# Altium project TIDA-010933-RevA.PrjPcb (part 1 of 8)
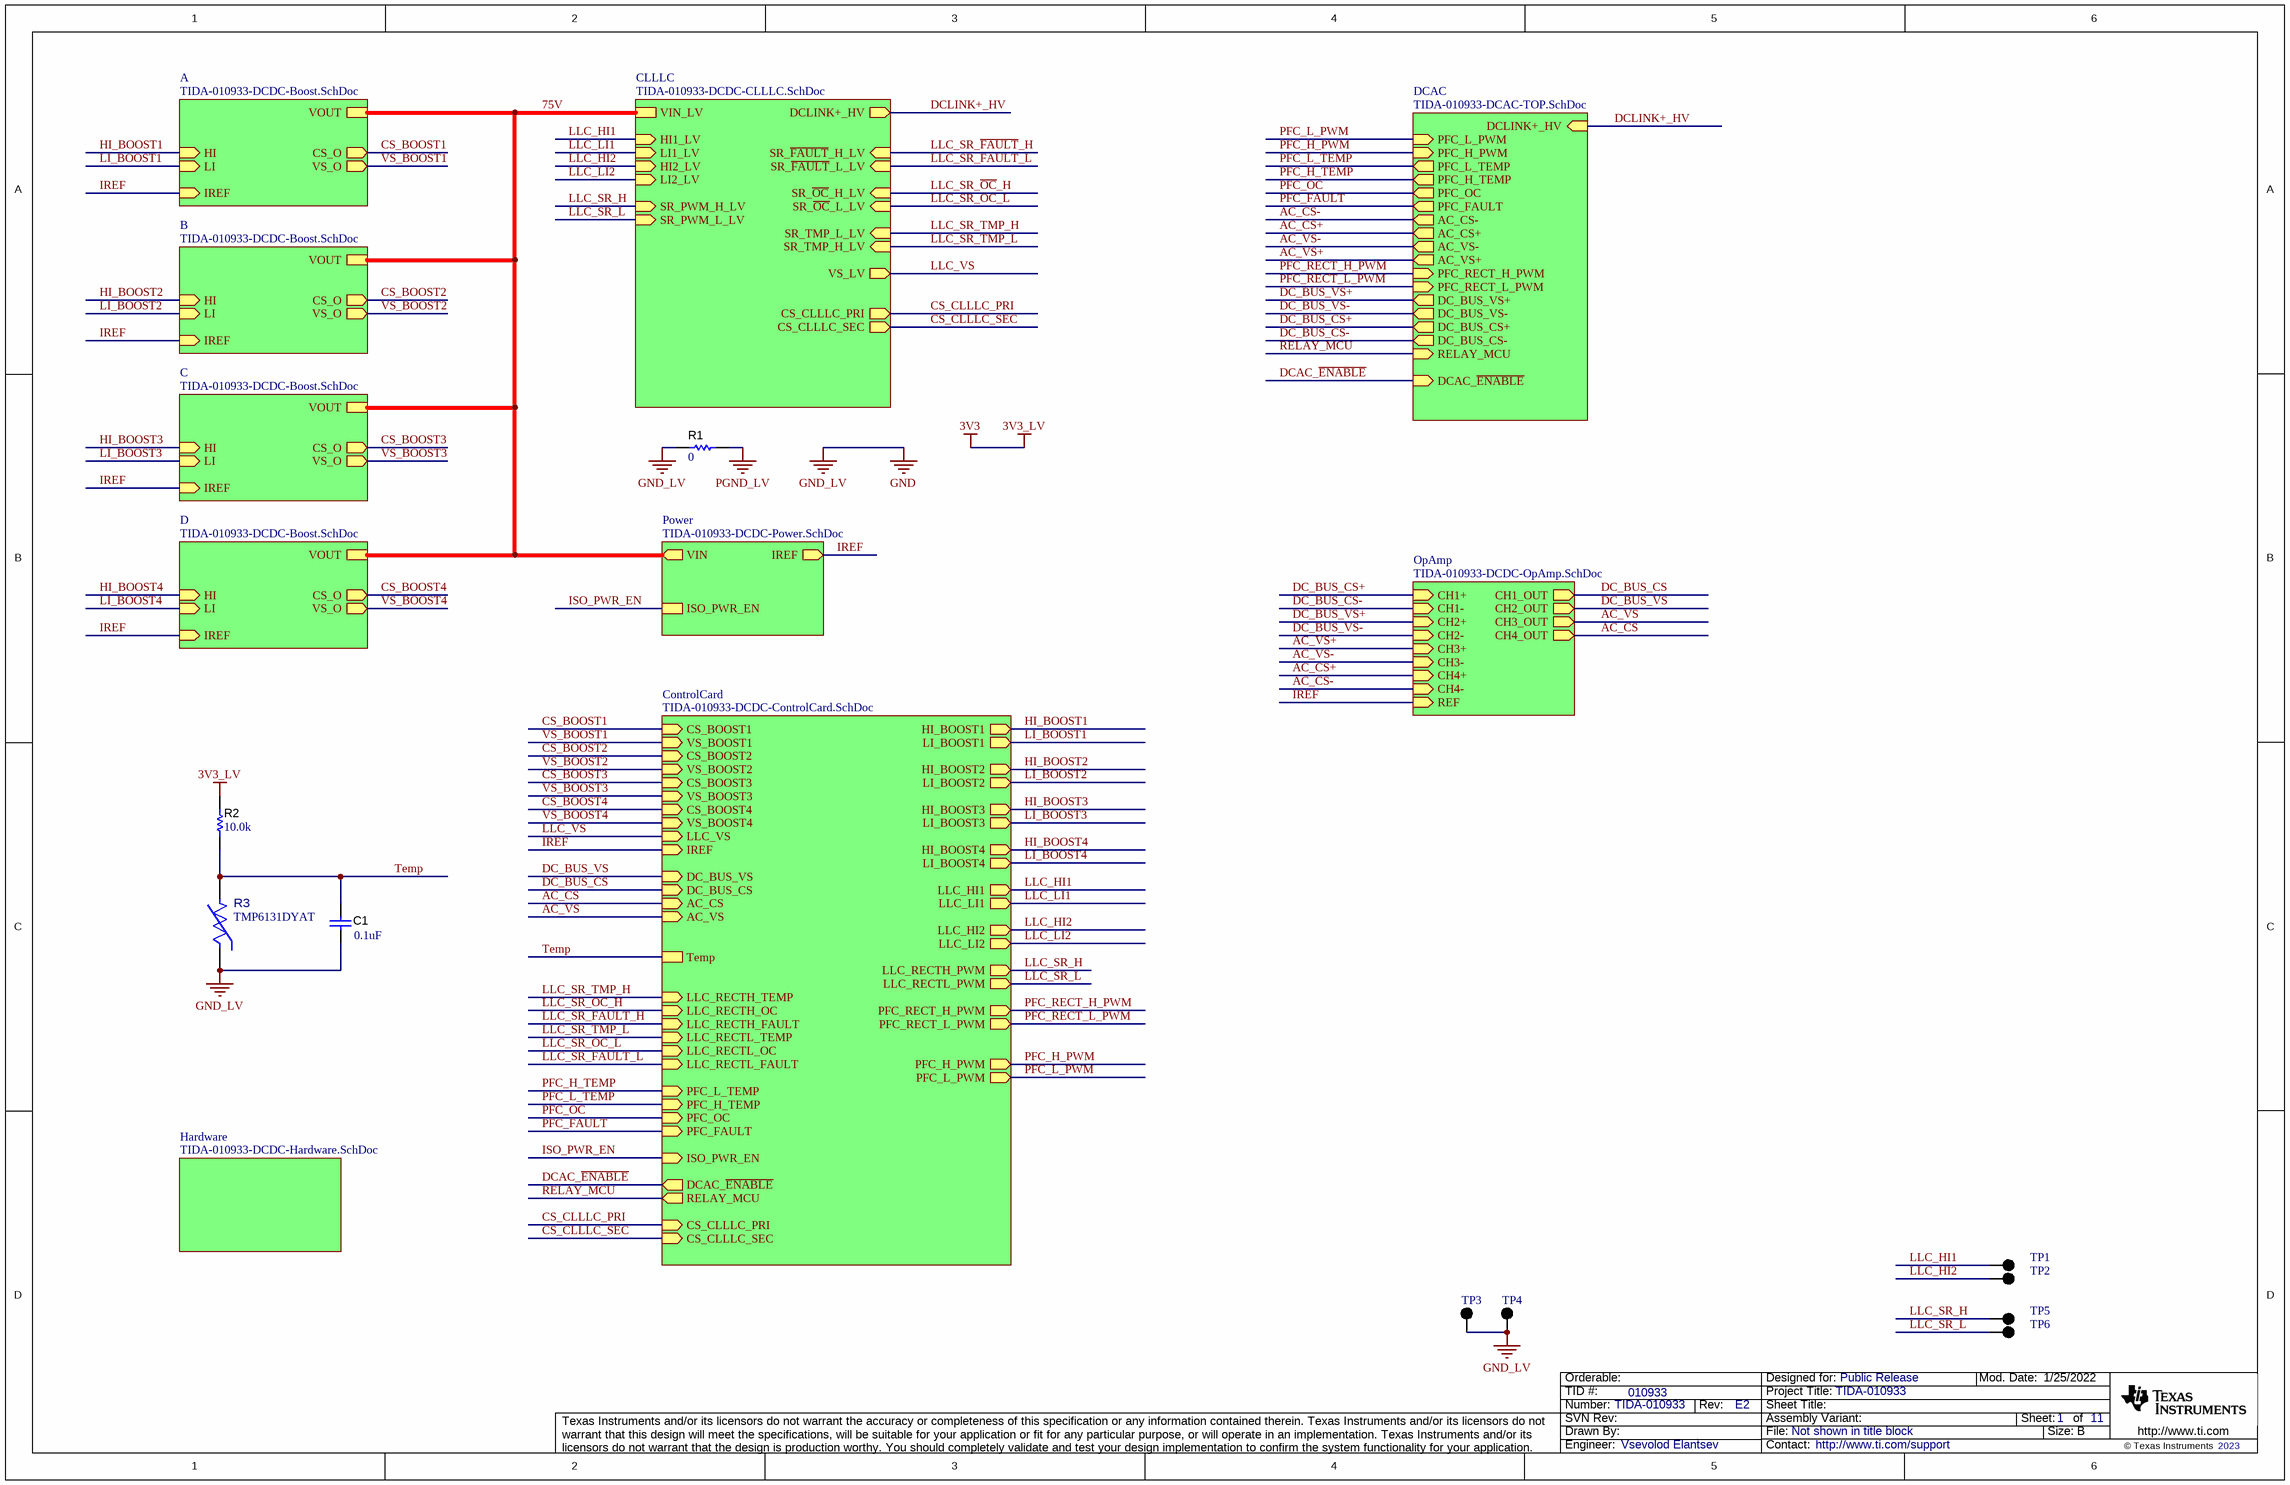
[diagram p0: TIDA-010933-DCDC-Top.SchDoc]
CopyrightYear: 2023; PCB_Rev: E2; PRJ_Customer: Public Release; PRJ_Engineer: Vsevolod Elantsev; PRJ_Number: TIDA-010933; PRJ_Title: TIDA-010933; SCH_Rev: E2; TechSupport: http://www.ti.com/support; TID: 010933; Vsevolod Elantsev: Who did the Layout?
11 sheets, 778 parts. Net scope: hierarchical (ports join the sheet entries above them; power ports are global).
Board file: TIDA-010933-RevA.PcbDoc
Sheets:
  TIDA-010933-DCDC-Top.SchDoc
    A = TIDA-010933-DCDC-Boost.SchDoc
    CLLLC = TIDA-010933-DCDC-CLLLC.SchDoc
      HV_GaN = TIDA-010933-DCDC-HVGAN.SchDoc
    B = TIDA-010933-DCDC-Boost.SchDoc
    C = TIDA-010933-DCDC-Boost.SchDoc
    D = TIDA-010933-DCDC-Boost.SchDoc
    Hardware = TIDA-010933-DCDC-Hardware.SchDoc
    Power = TIDA-010933-DCDC-Power.SchDoc
    ControlCard = TIDA-010933-DCDC-ControlCard.SchDoc
    OpAmp = TIDA-010933-DCDC-OpAmp.SchDoc
    DCAC = TIDA-010933-DCAC-TOP.SchDoc
      U_Power_Switches_1 = TIDA-010933-DCAC-SWITCHING-STAGE.SchDoc
      U_Aux_Power_Supply = TIDA-010933-DCAC-AUX-Power.SchDoc

## Sheet TIDA-010933-DCDC-Top.SchDoc
size 431 x 279 mm; Date: Not shown in title block; ApprovedBy: Not shown in title block; CheckedBy: Not shown in title block; Author: Not shown in title block; CompanyName: Not shown in title block; Engineer: Not shown in title block; Organization: Not shown in title block; Address1: Not shown in title block; Address2: Not shown in title block; Address3: Not shown in title block; Address4: Not shown in title block; DocumentNumber: 2; Revision: Use project parameter SCH_Rev; SheetNumber: 1; SheetTotal: 11; PageSetup: Record=PageOptions|CenterHorizontal=True|CenterVertical=True|PrintScale=1.00|XCorrection=1.00|YCorrection=1.00|PrintKind=0|BorderSize=5000000|LeftOffset=0|BottomOffset=0|Orientation=2|PaperLength=1000|PaperWidth=1000|Scale=100|PaperSource=15|PrintQuality=600|MediaType=1|DitherType=10|PaperKind=Letter|PrintScaleMode=1; CurrentTime: Not shown in title block; CurrentDate: Not shown in title block; Time: Not shown in title block; DocumentFullPathAndName: Not shown in title block; DocumentName: Not shown in title block; ModifiedDate: 1/25/2022; ImagePath: Not shown in title block

### Parts
C1  ValueDisplayed: 0.1uF  [0402]  (hidden comment: GRM155R71E104KE14D)
R1  ValueDisplayed: 0  [0603]  (hidden comment: RC0603JR-070RL)
R2  ValueDisplayed: 10.0k  [0402]  (hidden comment: RT0402BRD0710KL)
R3  TMP6131DYAT  [DYA0002A-MFG]
TP1  5001  [Keystone5001]  (value not drawn)
TP2  5001  [Keystone5001]  (value not drawn)
TP3  5001  [Keystone5001]  (value not drawn)
TP4  5001  [Keystone5001]  (value not drawn)
TP5  5001  [Keystone5001]  (value not drawn)
TP6  5001  [Keystone5001]  (value not drawn)

### Sub-sheets
A = TIDA-010933-DCDC-Boost.SchDoc: HI (in), LI (in), VOUT, CS_O (out), VS_O (out), IREF (in)
B = TIDA-010933-DCDC-Boost.SchDoc: HI (in), LI (in), VOUT, CS_O (out), VS_O (out), IREF (in)
C = TIDA-010933-DCDC-Boost.SchDoc: HI (in), LI (in), VOUT, CS_O (out), VS_O (out), IREF (in)
CLLLC = TIDA-010933-DCDC-CLLLC.SchDoc: VIN_LV, HI1_LV (in), LI1_LV (in), HI2_LV (in), LI2_LV (in), SR_PWM_H_LV (in), SR_PWM_L_LV (in), SR_~{FAULT}_L_LV (in), SR_~{FAULT}_H_LV (in), SR_~{OC}_H_LV (in), SR_~{OC}_L_LV (in), SR_TMP_L_LV (in), SR_TMP_H_LV (in), DCLINK+_HV (out), VS_LV (out), CS_CLLLC_PRI (out), CS_CLLLC_SEC (out)
ControlCard = TIDA-010933-DCDC-ControlCard.SchDoc: CS_BOOST1 (in), VS_BOOST1 (in), CS_BOOST2 (in), VS_BOOST2 (in), CS_BOOST3 (in), VS_BOOST3 (in), CS_BOOST4 (in), VS_BOOST4 (in), DC_BUS_VS (in), DC_BUS_CS (in), LLC_VS (in), IREF (in), LLC_HI1 (out), LLC_HI2 (out), LLC_LI1 (out), LLC_LI2 (out), LLC_RECTH_TEMP (in), LLC_RECTL_TEMP (in), PFC_H_TEMP (in), PFC_L_TEMP (in), PFC_OC (in), PFC_FAULT (in), HI_BOOST1 (out), LI_BOOST1 (out), HI_BOOST2 (out), LI_BOOST2 (out), HI_BOOST3 (out), LI_BOOST3 (out), HI_BOOST4 (out), LI_BOOST4 (out), LLC_RECTH_OC (in), LLC_RECTH_FAULT (in), LLC_RECTL_OC (in), LLC_RECTL_FAULT (in), AC_CS (in), AC_VS (in), LLC_RECTH_PWM (out), LLC_RECTL_PWM (out), PFC_RECT_H_PWM (out), PFC_RECT_L_PWM (out), PFC_H_PWM (out), PFC_L_PWM (out), ISO_PWR_EN (in), DCAC_~{ENABLE} (out), RELAY_MCU (out), Temp, CS_CLLLC_PRI (in), CS_CLLLC_SEC (in)
D = TIDA-010933-DCDC-Boost.SchDoc: HI (in), LI (in), VOUT, CS_O (out), VS_O (out), IREF (in)
DCAC = TIDA-010933-DCAC-TOP.SchDoc: DCLINK+_HV (in), PFC_L_PWM (in), PFC_H_PWM (in), PFC_L_TEMP (out), PFC_H_TEMP (out), PFC_OC (out), PFC_FAULT (out), AC_CS- (out), AC_CS+ (out), AC_VS- (out), AC_VS+ (out), PFC_RECT_H_PWM (in), PFC_RECT_L_PWM (in), DC_BUS_VS+ (out), DC_BUS_VS- (out), DC_BUS_CS+ (out), DC_BUS_CS- (out), RELAY_MCU (in), DCAC_~{ENABLE} (in)
Hardware = TIDA-010933-DCDC-Hardware.SchDoc: no entries
OpAmp = TIDA-010933-DCDC-OpAmp.SchDoc: CH1+ (in), CH1- (in), REF (in), CH2+ (in), CH2- (in), CH3+ (in), CH3- (in), CH4+ (in), CH4- (in), CH1_OUT (out), CH2_OUT (out), CH3_OUT (out), CH4_OUT (out)
Power = TIDA-010933-DCDC-Power.SchDoc: IREF (out), VIN (out), ISO_PWR_EN

### Nets
3V3: R2.2  [also labelled 3V3_LV]
GND: C1.2 R1.1 R3.2(+) TP3.1 TP4.1  [also labelled GND_LV]
PGND_LV: R1.2
75V: sheet A/VOUT, sheet CLLLC/VIN_LV, sheet B/VOUT, sheet C/VOUT, sheet D/VOUT, sheet Power/VIN
AC_CS: sheet ControlCard/AC_CS, sheet OpAmp/CH4_OUT
AC_CS+: sheet OpAmp/CH4+, sheet DCAC/AC_CS+
AC_CS-: sheet OpAmp/CH4-, sheet DCAC/AC_CS-
AC_VS: sheet ControlCard/AC_VS, sheet OpAmp/CH3_OUT
AC_VS+: sheet OpAmp/CH3+, sheet DCAC/AC_VS+
AC_VS-: sheet OpAmp/CH3-, sheet DCAC/AC_VS-
CS_BOOST1: sheet A/CS_O, sheet ControlCard/CS_BOOST1
CS_BOOST2: sheet B/CS_O, sheet ControlCard/CS_BOOST2
CS_BOOST3: sheet C/CS_O, sheet ControlCard/CS_BOOST3
CS_BOOST4: sheet D/CS_O, sheet ControlCard/CS_BOOST4
CS_CLLLC_PRI: sheet CLLLC/CS_CLLLC_PRI, sheet ControlCard/CS_CLLLC_PRI
CS_CLLLC_SEC: sheet CLLLC/CS_CLLLC_SEC, sheet ControlCard/CS_CLLLC_SEC
DC_BUS_CS: sheet ControlCard/DC_BUS_CS, sheet OpAmp/CH1_OUT
DC_BUS_CS+: sheet OpAmp/CH1+, sheet DCAC/DC_BUS_CS+
DC_BUS_CS-: sheet OpAmp/CH1-, sheet DCAC/DC_BUS_CS-
DC_BUS_VS: sheet ControlCard/DC_BUS_VS, sheet OpAmp/CH2_OUT
DC_BUS_VS+: sheet OpAmp/CH2+, sheet DCAC/DC_BUS_VS+
DC_BUS_VS-: sheet OpAmp/CH2-, sheet DCAC/DC_BUS_VS-
DCAC_~{ENABLE}: sheet ControlCard/DCAC_~{ENABLE}, sheet DCAC/DCAC_~{ENABLE}
DCLINK+_HV: sheet CLLLC/DCLINK+_HV, sheet DCAC/DCLINK+_HV
HI_BOOST1: sheet A/HI, sheet ControlCard/HI_BOOST1
HI_BOOST2: sheet B/HI, sheet ControlCard/HI_BOOST2
HI_BOOST3: sheet C/HI, sheet ControlCard/HI_BOOST3
HI_BOOST4: sheet D/HI, sheet ControlCard/HI_BOOST4
IREF: sheet A/IREF, sheet B/IREF, sheet C/IREF, sheet D/IREF, sheet Power/IREF, sheet ControlCard/IREF, sheet OpAmp/REF
ISO_PWR_EN: sheet Power/ISO_PWR_EN, sheet ControlCard/ISO_PWR_EN
LI_BOOST1: sheet A/LI, sheet ControlCard/LI_BOOST1
LI_BOOST2: sheet B/LI, sheet ControlCard/LI_BOOST2
LI_BOOST3: sheet C/LI, sheet ControlCard/LI_BOOST3
LI_BOOST4: sheet D/LI, sheet ControlCard/LI_BOOST4
LLC_HI1: TP1.1 ; sheet CLLLC/HI1_LV, sheet ControlCard/LLC_HI1
LLC_HI2: TP2.1 ; sheet CLLLC/HI2_LV, sheet ControlCard/LLC_HI2
LLC_LI1: sheet CLLLC/LI1_LV, sheet ControlCard/LLC_LI1
LLC_LI2: sheet CLLLC/LI2_LV, sheet ControlCard/LLC_LI2
LLC_SR_~{FAULT}_H: sheet CLLLC/SR_~{FAULT}_H_LV, sheet ControlCard/LLC_RECTH_FAULT
LLC_SR_~{FAULT}_L: sheet CLLLC/SR_~{FAULT}_L_LV, sheet ControlCard/LLC_RECTL_FAULT
LLC_SR_H: TP5.1 ; sheet CLLLC/SR_PWM_H_LV, sheet ControlCard/LLC_RECTH_PWM
LLC_SR_L: TP6.1 ; sheet CLLLC/SR_PWM_L_LV, sheet ControlCard/LLC_RECTL_PWM
LLC_SR_~{OC}_H: sheet CLLLC/SR_~{OC}_H_LV, sheet ControlCard/LLC_RECTH_OC
LLC_SR_~{OC}_L: sheet CLLLC/SR_~{OC}_L_LV, sheet ControlCard/LLC_RECTL_OC
LLC_SR_TMP_H: sheet CLLLC/SR_TMP_L_LV, sheet ControlCard/LLC_RECTH_TEMP
LLC_SR_TMP_L: sheet CLLLC/SR_TMP_H_LV, sheet ControlCard/LLC_RECTL_TEMP
LLC_VS: sheet CLLLC/VS_LV, sheet ControlCard/LLC_VS
PFC_FAULT: sheet ControlCard/PFC_FAULT, sheet DCAC/PFC_FAULT
PFC_H_PWM: sheet ControlCard/PFC_H_PWM, sheet DCAC/PFC_H_PWM
PFC_H_TEMP: sheet ControlCard/PFC_L_TEMP, sheet DCAC/PFC_H_TEMP
PFC_L_PWM: sheet ControlCard/PFC_L_PWM, sheet DCAC/PFC_L_PWM
PFC_L_TEMP: sheet ControlCard/PFC_H_TEMP, sheet DCAC/PFC_L_TEMP
PFC_OC: sheet ControlCard/PFC_OC, sheet DCAC/PFC_OC
PFC_RECT_H_PWM: sheet ControlCard/PFC_RECT_H_PWM, sheet DCAC/PFC_RECT_H_PWM
PFC_RECT_L_PWM: sheet ControlCard/PFC_RECT_L_PWM, sheet DCAC/PFC_RECT_L_PWM
RELAY_MCU: sheet ControlCard/RELAY_MCU, sheet DCAC/RELAY_MCU
Temp: C1.1 R2.1 R3.1(-) ; sheet ControlCard/Temp
VS_BOOST1: sheet A/VS_O, sheet ControlCard/VS_BOOST1
VS_BOOST2: sheet B/VS_O, sheet ControlCard/VS_BOOST2
VS_BOOST3: sheet C/VS_O, sheet ControlCard/VS_BOOST3
VS_BOOST4: sheet D/VS_O, sheet ControlCard/VS_BOOST4

### Notes on the sheet
- Drawn By:
- SVN Rev:
- Number:
- TID #:
- Orderable:
- Rev:
- Sheet Title:
- File:
- Project Title:
- Designed for:
- Assembly Variant:
- Mod. Date:
- Sheet:
- Size:
- of
- B
- http://www.ti.com
- Texas Instruments and/or its licensors do not warrant the accuracy or completeness of this specification or any information contained therein. Texas Instruments and/or its licensors do not warrant that this design will meet the specifications, will be suitable for your application or fit for any particular purpose, or will operate in an implementation. Texas Instruments and/or its licensors do not warrant that the design is production worthy. You should completely validate and test your design implementation to confirm the system functionality for your application.
- Engineer:
- Contact:
- © Texas Instruments

### Library data of the parts
C1 = CMP-0006659-2: CAP, CERM, 0.1 uF, 25 V, +/- 10%, X7R, 0402; Manufacturer: MuRata; TaMin_C: -55°C; Polarized: N; SizeAreaWB_mm2: 3; Value1: Unknown; U/M: EA; Value: 0.1uF; TaMax_C: 125°C; SizeZ_mm: 0.6; SizeX_mm: 1; SizeY_mm: 0.5; Value2: 25V; Cap_F: 100nF; AEC Category: Q200; Supplier Part Number 2: 31Y1751; Publisher: Texas Instruments; Supplier 2: Newark; Supplier Part Number 3: 81-GRM155R71E104KE4D; TempCo: X7R; Supplier 3: Mouser; Published: 2008-06-19; RoHS: Y; MountType: SMT; Supplier 1: Digi-Key; PackageReference: 0402; Tolerance_%: 10%; Cap_Case: 0402; SizeArea_mm2: 0.5; CompType: Capacitor; LatestRevisionDate: 2017-03-09; PartNumber: GRM155R71E104KE14D; AEC Qualified: N; VDC_V: 25V; ComponentLink1Description: Datasheet link; AEC Grade: N/A; Supplier Part Number 1: 490-10698-1-ND; Technology: Ceramic; ComponentLink1URL: http://search.murata.co.jp/Ceramy/image/img/A01X/G101/ENG/GRM155R71E104KE14-01.pdf
R1 = CMP-0025885-5: RES, 0, 5%, 0.1 W, 0603; Manufacturer: Yageo; Power_W: 100mW; TempCo: 200 ppm/C; Value_Code: 0000; Value: 0; EIA_Code: E24; SizeX_mm: 1.6; SizeZ_mm: 1; Value2: 0.1W; SizeArea_mm2: 1.28; AEC Qualified: N; VDC_V: 75V; AEC Category: Q200; SizeY_mm: 0.8; SizeAreaWB_mm2: 4.68; Supplier Part Number 2: 603-RC0603JR-070RL; Supplier 2: Mouser; Supplier Part Number 3: 9233130; Supplier 3: Farnell; RoHS: Y; Value1: 5%; MountType: SMT; Supplier 1: Digi-Key; PackageReference: 0603; Tolerance_%: 5%; Res_ohm: 0; CompType: Resistor; PartNumber: RC0603JR-070RL; ComponentLink1Description: Datasheet link; Supplier Part Number 1: 311-0.0GRCT-ND; Technology: Thick Film; ComponentLink1URL: http://www.yageo.com/pdf/Pu-RC0603_51_PbFree_L_2.pdf; AEC Grade: N/A
R2 = CMP-0065360-1: RES, 10.0 k, .1%, .0625 W, 0402; Manufacturer: Yageo America; Power_W: 62.5mW; TempCo: 25 ppm/C; Value_Code: 10k0; U/M: EA; Value: 10.0k; EIA_Code: E192; Tolerance_%: 0.1%; Res_ohm: 10k; SizeX_mm: 1.0; SizeY_mm: 0.5; SizeZ_mm: 0.6; Value2: .0625W; VDC_V: 50V; AEC Category: Q200; ComponentLink1URL: http://www.yageo.com/NewPortal/yageodocoutput?fileName=/pdf/R-Chip/PYu-RT_1-to-0.01_RoHS_L_8.pdf; Supplier Part Number 2: 66R6774; Publisher: Texas Instruments; Supplier 2: Newark; Supplier Part Number 3: 603-RT0402BRD0710KL; Supplier 3: Mouser; Published: 2008-06-26; RoHS: Y; Value1: .1%; MountType: SMT; Supplier 1: Digi-Key; PackageReference: 0402; SizeArea_mm2: 0.5; CompType: Resistor; LatestRevisionDate: 2017-06-05; PartNumber: RT0402BRD0710KL; AEC Qualified: ?; ComponentLink1Description: Datasheet link; Supplier Part Number 1: YAG1346CT-ND; Technology: Thin Film
R3 = CMP-0091865-1: ±1% tolerance 10kΩ linear thermistor available in 0402 and 0603 package options 2-SOT-5X3 -40 to 125; Manufacturer: Texas Instruments; Max Current: 400uA; AEC Qualified: No; Value: 10k; TJmax_C: +155°C; TaMin_C: -40°C; TempCo: 6400ppm/°C; TaMax_C: +125°C; VDC_V: 5.5V; SizeZ_mm: 0.77mm; RoHS: TRUE; Mouser Description: ±1% tolerance 10kO linear thermistor available in 0402 and 0603 package options 2-SOT-5X3 -40 to 125; PackageReference: SOD-523; Operating Temperature Range: -40°C to +125°C; Digikey Part Number: 296-TMP6131DYATCT-ND; Res_ohm: 10kΩ; Mouser Part Number: 595-TMP6131DYAT; ComponentLink1Description: Datasheet; helpURL: https://upverter.com/upn/revision/150d27163111d799/; datasheet: https://www.ti.com/lit/gpn/TMP61; ComponentLink1URL: https://www.ti.com/lit/gpn/TMP61; Tolerance_%: 1%; Series: TMP61; Digikey Description: THERMISTOR; Datasheet Path: datasheets/Res-TMP6131DYAT.pdf; PartNumber: TMP6131DYAT; Lead Free: Yes; Part Number: TMP6131DYAT
TP1-TP6 = CMP-0055138-2: Test Point, Miniature, Black, TH; Manufacturer: Keystone Electronics; ContactFinish: Silver; CNHeader: FALSE; Green_Lifecycle: Active; Green_REACh: Passed; CT: TRUE; Color: Black; PackageReference: Black Miniature Testpoint; LatestRevisionDate: 26/05/2017; MountType: TH; Publisher: Texas Instruments; Green_EU RoHS-2: Incomplete; PartNumber: 5001; Supplier 1: Digi-Key; Supplier Part Number 1: 36-5001-ND; ComponentLink1URL: http://www.keyelco.com/userAssets/file/M60-2p60.pdf; ComponentLink1Description: Datasheet URL; RoHS: Y; Supplier 2: Mouser; Green_EU RoHS: Passed; CompType: Test Point; Supplier Part Number 2: 534-5001

## Sheet TIDA-010933-DCDC-Boost.SchDoc
size 431 x 279 mm; Date: Not shown in title block; ApprovedBy: Not shown in title block; CheckedBy: Not shown in title block; Author: Not shown in title block; CompanyName: Not shown in title block; Engineer: Not shown in title block; Organization: Not shown in title block; Address1: Not shown in title block; Address2: Not shown in title block; Address3: Not shown in title block; Address4: Not shown in title block; DocumentNumber: 2; Revision: Use project parameter SCH_Rev; SheetNumber: 2; SheetTotal: 11; PageSetup: Record=PageOptions|CenterHorizontal=True|CenterVertical=True|PrintScale=1.00|XCorrection=1.00|YCorrection=1.00|PrintKind=0|BorderSize=5000000|LeftOffset=0|BottomOffset=0|Orientation=2|PaperLength=1000|PaperWidth=1000|Scale=100|PaperSource=15|PrintQuality=600|MediaType=1|DitherType=10|PaperKind=Letter|PrintScaleMode=1; CurrentTime: Not shown in title block; CurrentDate: Not shown in title block; Time: Not shown in title block; DocumentFullPathAndName: Not shown in title block; DocumentName: Not shown in title block; ModifiedDate: 1/25/2022; ImagePath: Not shown in title block
Used 4 times, as channels A, B, C, D. Parts and nets are listed once, with the designators drawn on the sheet.
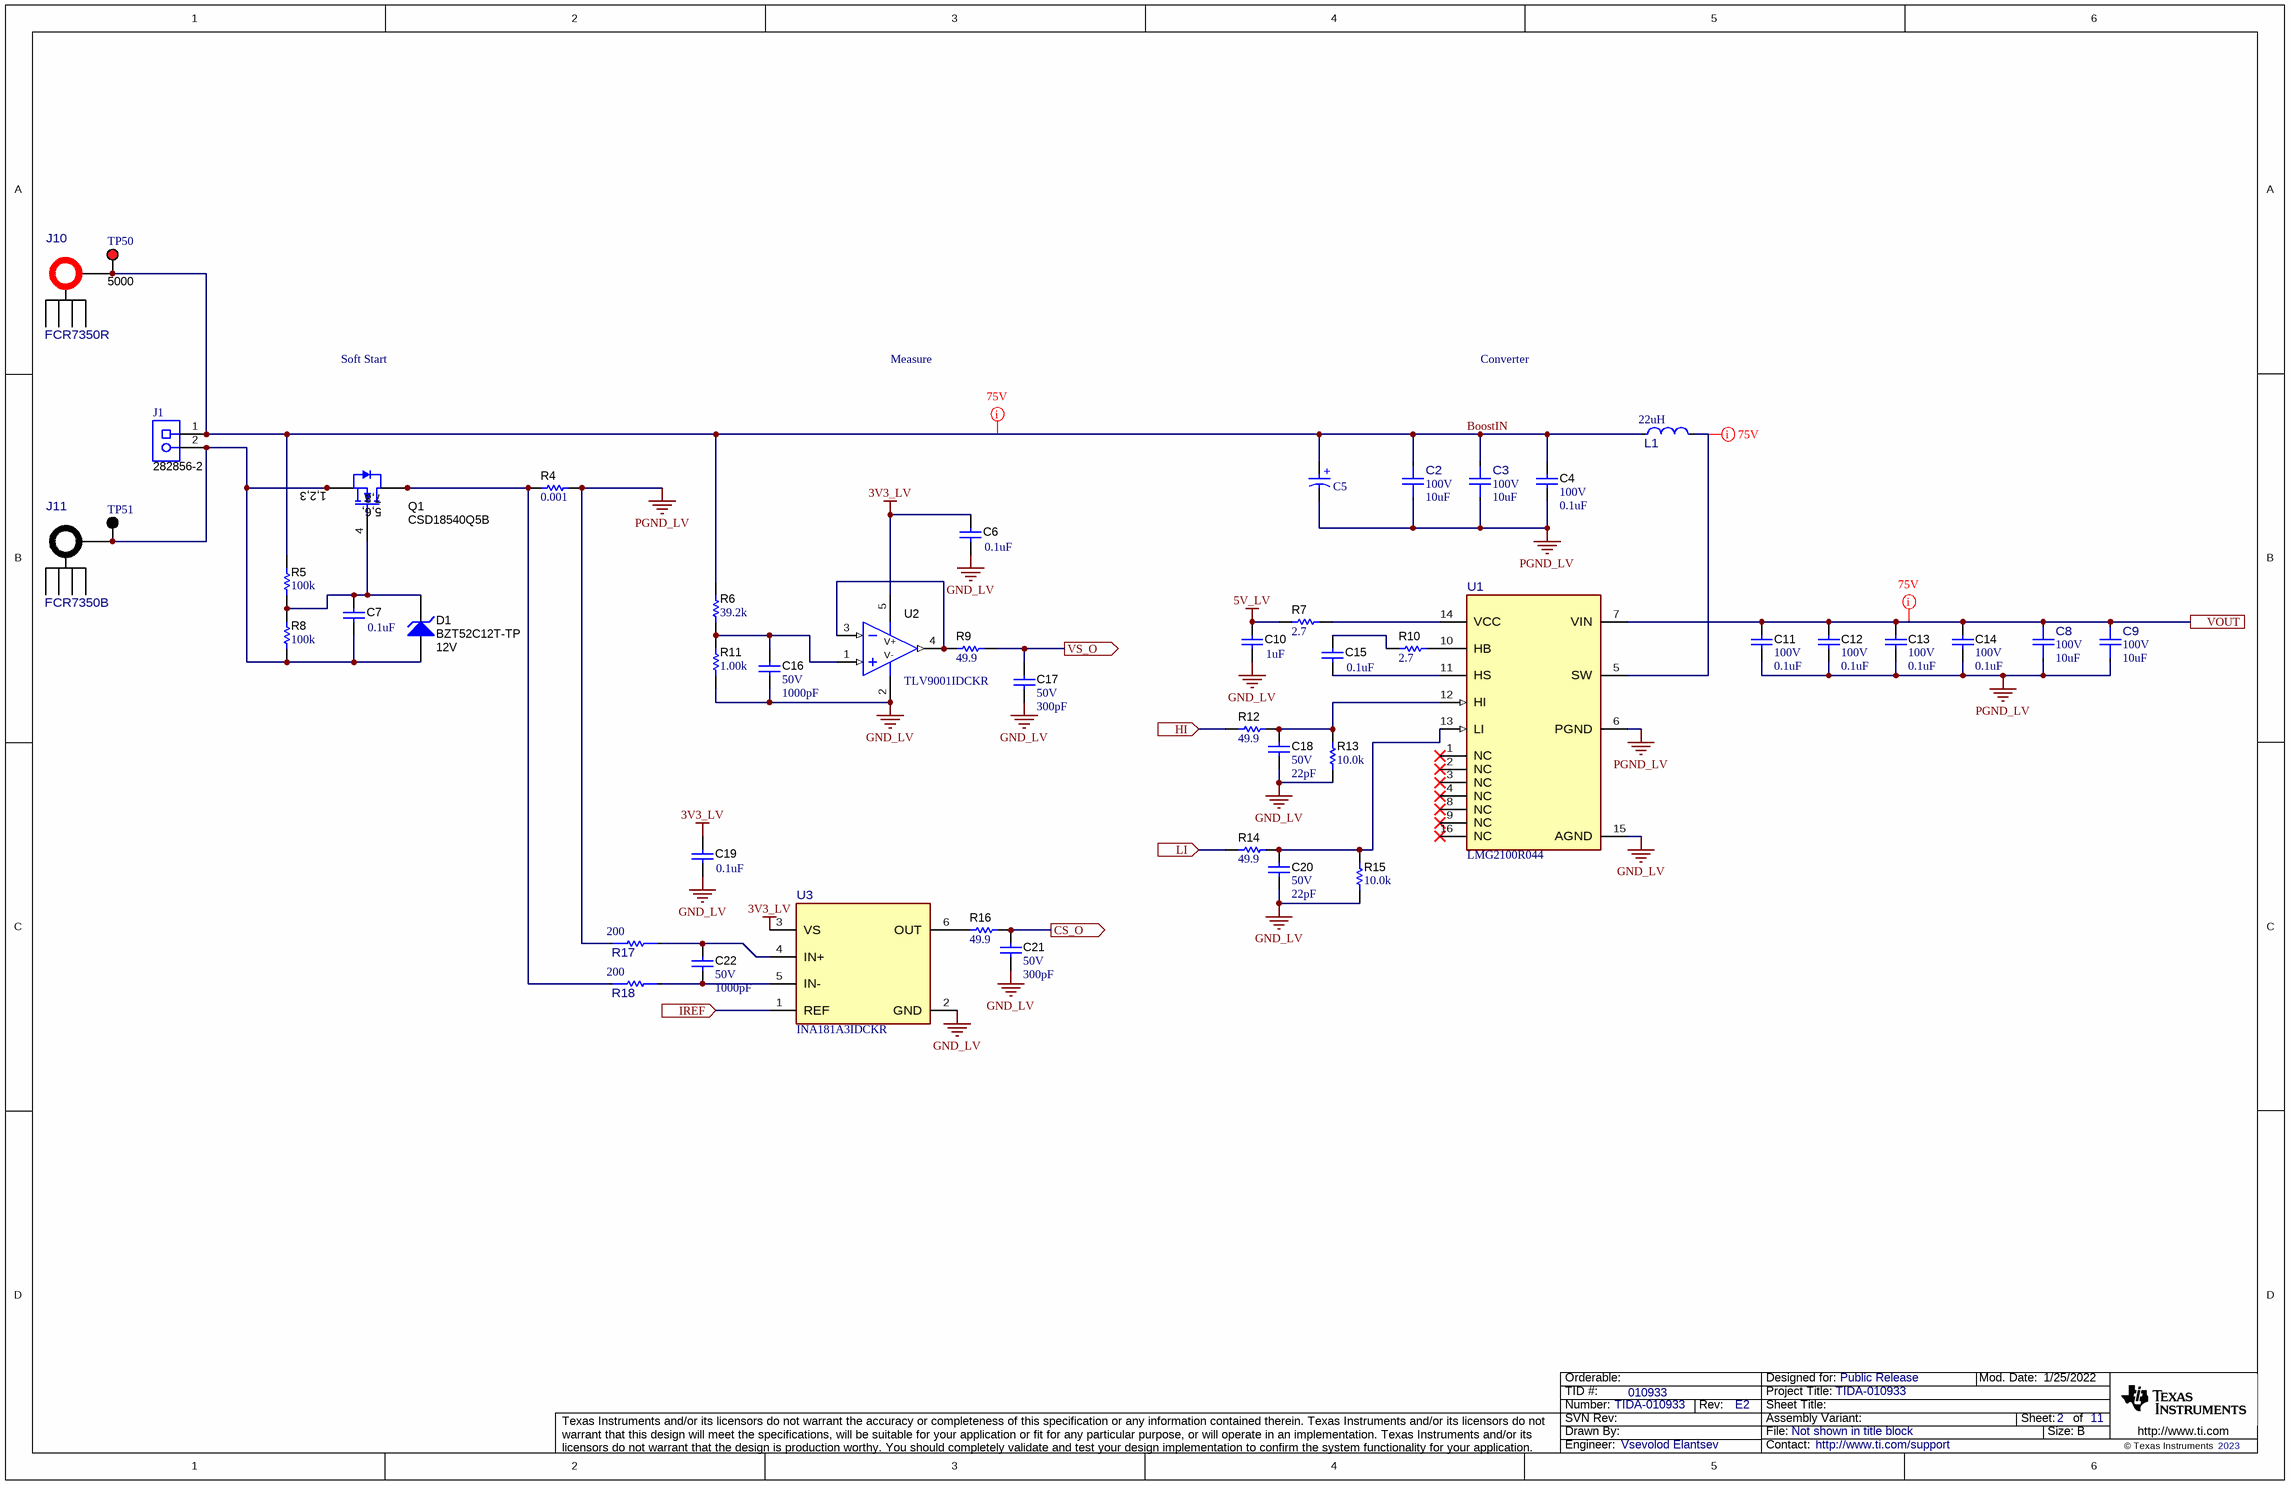
[diagram p1: TIDA-010933-DCDC-Boost.SchDoc]

### Parts
C2  VDC_V: 100V  ValueDisplayed: 10uF  [FP-C3225X7R2A106K250AC_1210-MFG]  (hidden comment: C3225X7R2A106K250AC)
C3  VDC_V: 100V  ValueDisplayed: 10uF  [FP-C3225X7R2A106K250AC_1210-MFG]  (hidden comment: C3225X7R2A106K250AC)
C4  VDC_V: 100V  ValueDisplayed: 0.1uF  [0402]  (hidden comment: GRM155R62A104KE14D)
C5  860080775016  [WCAP-ATLI_D10H16]  (value not drawn)
C6  ValueDisplayed: 0.1uF  [0402]  (hidden comment: GRM155R71E104KE14D)
C7  ValueDisplayed: 0.1uF  [0402]  (hidden comment: GRM155R71E104KE14D)
C8  VDC_V: 100V  ValueDisplayed: 10uF  [FP-C3225X7R2A106K250AC_1210-MFG]  (hidden comment: C3225X7R2A106K250AC)
C9  VDC_V: 100V  ValueDisplayed: 10uF  [FP-C3225X7R2A106K250AC_1210-MFG]  (hidden comment: C3225X7R2A106K250AC)
C10  ValueDisplayed: 1uF  [0402]  (hidden comment: GRM155R61E105KA12D)
C11  VDC_V: 100V  ValueDisplayed: 0.1uF  [0402]  (hidden comment: GRM155R62A104KE14D)
C12  VDC_V: 100V  ValueDisplayed: 0.1uF  [0402]  (hidden comment: GRM155R62A104KE14D)
C13  VDC_V: 100V  ValueDisplayed: 0.1uF  [0402]  (hidden comment: GRM155R62A104KE14D)
C14  VDC_V: 100V  ValueDisplayed: 0.1uF  [0402]  (hidden comment: GRM155R62A104KE14D)
C15  ValueDisplayed: 0.1uF  [0402]  (hidden comment: GRM155R71E104KE14D)
C16  VDC_V: 50V  ValueDisplayed: 1000pF  [0402]  (hidden comment: GRM1555C1H102JA01D)
C17  VDC_V: 50V  ValueDisplayed: 300pF  [0402]  (hidden comment: GRM1555C1H301JA01D)
C18  VDC_V: 50V  ValueDisplayed: 22pF  [0402]  (hidden comment: CC0402JRNPO9BN220)
C19  ValueDisplayed: 0.1uF  [0402]  (hidden comment: GRM155R71E104KE14D)
C20  VDC_V: 50V  ValueDisplayed: 22pF  [0402]  (hidden comment: CC0402JRNPO9BN220)
C21  VDC_V: 50V  ValueDisplayed: 300pF  [0402]  (hidden comment: GRM1555C1H301JA01D)
C22  VDC_V: 50V  ValueDisplayed: 1000pF  [0402]  (hidden comment: GRM1555C1H102JA01D)
D1  BZT52C12T-TP  value 12V  [SOD-523]
J1  282856-2  [TE_282856-2]
J10  FCR7350R  [FP-FCR7350R_CONN_BANANA_JACK-MFG]
J11  FCR7350B  [FP-FCR7350B_CONN_BANANA_JACK-MFG]
L1  value 22uH  [FP-VER2923-223KL_PTH_INDUCTOR_26MM92_16MM46-MFG]  (hidden comment: VER2923-223KL)
Q1  CSD18540Q5B  [DNK0008A]
R4  ValueDisplayed: 0.001  [1206]  (hidden comment: CRF1206-FZ-R001ELF)
R5  ValueDisplayed: 100k  [0603]  (hidden comment: RC0603FR-07100KL)
R6  ValueDisplayed: 39.2k  [0603]  (hidden comment: RT0603BRD0739K2L)
R7  ValueDisplayed: 2.7  [0402]  (hidden comment: CRCW04022R70JNED)
R8  ValueDisplayed: 100k  [0402]  (hidden comment: RC0402FR-07100KL)
R9  ValueDisplayed: 49.9  [0402]  (hidden comment: RC0402FR-0749R9L)
R10  ValueDisplayed: 2.7  [0402]  (hidden comment: CRCW04022R70JNED)
R11  ValueDisplayed: 1.00k  [0402]  (hidden comment: ERA-2AEB102X)
R12  ValueDisplayed: 49.9  [0402]  (hidden comment: RC0402FR-0749R9L)
R13  ValueDisplayed: 10.0k  [0402]  (hidden comment: RC0402FR-0710KL)
R14  ValueDisplayed: 49.9  [0402]  (hidden comment: RC0402FR-0749R9L)
R15  ValueDisplayed: 10.0k  [0402]  (hidden comment: RC0402FR-0710KL)
R16  ValueDisplayed: 49.9  [0402]  (hidden comment: RC0402FR-0749R9L)
R17  value 200  [FP-RC0402JR-07200RL_0402-MFG]  (hidden comment: RC0402JR-07200RL)
R18  value 200  [FP-RC0402JR-07200RL_0402-MFG]  (hidden comment: RC0402JR-07200RL)
TP50  5000  [Keystone5000]
TP51  5001  [Keystone5001]  (value not drawn)
U1  LMG2100R044  [VBN0016A-MFG]
U2  TLV9001IDCKR  [DCK0005A_N]
U3  INA181A3IDCKR  [DCK0006A-MFG]

### Ports
CS_O (out), HI (in), IREF (in), LI (in), VOUT, VS_O (out)

### Nets
3V3_LV: C6.1 C19.1 U2.5(V+) U3.3(VS)
5V_LV: C10.1 R7.1
GND_LV: C6.2 C10.2 C16.2 C17.2 C18.2 C19.2 C20.2 C21.2 R11.1 R13.1 R15.1 U1.15(AGND) U2.2(V-) U3.2(GND)
PGND_LV: C2.1 C3.1 C4.2 C5.2(N) C8.1 C9.1 C11.2 C12.2 C13.2 C14.2 R4.2 R17.1 U1.6(PGND)
BoostIN: C2.2 C3.2 C4.1 C5.1(P) J1.1 J10.1 L1.1 R5.2 R6.2 TP50.1
CS_O: C21.1 R16.2 ; port CS_O
HI: R12.1 ; port HI
IREF: U3.1(REF) ; port IREF
LI: R14.1 ; port LI
VOUT: C8.2 C9.2 C11.1 C12.1 C13.1 C14.1 U1.7(VIN) ; port VOUT
VS_O: C17.1 R9.2 ; port VS_O
NetC7_1: C7.1 D1.1(K) Q1.4(G) R5.1 R8.2
NetC7_2: C7.2 D1.2(A) J1.2 J11.1 Q1.1(S) Q1.2(S) Q1.3(S) R8.1 TP51.1
NetC15_1: C15.1 R10.1
NetC15_2: C15.2 U1.11(HS)
NetC16_1: C16.1 R6.1 R11.2 U2.1(IN+)
NetC18_1: C18.1 R12.2 R13.2 U1.12(HI)
NetC20_1: C20.1 R14.2 R15.2 U1.13(LI)
NetC22_1: C22.1 R17.2 U3.4(IN+)
NetC22_2: C22.2 R18.2 U3.5(IN-)
NetL1_2: L1.2 U1.5(SW)
NetQ1_5: Q1.5(D) Q1.6(D) Q1.7(D) Q1.8(D) Q1.9(D) R4.1 R18.1
NetR7_2: R7.2 U1.14(VCC)
NetR9_1: R9.1 U2.3(IN-) U2.4(OUT)
NetR10_2: R10.2 U1.10(HB)
NetR16_1: R16.1 U3.6(OUT)

Not connected (* = marked no-connect by the designer): J10 2(MNT_1) 3(MNT_2) 4(MNT_3) 5(MNT_4); J11 2(MNT_1) 3(MNT_2) 4(MNT_3) 5(MNT_4); U1 1(NC)* 2(NC)* 3(NC)* 4(NC)* 8(NC)* 9(NC)* 16(NC)*

### Channels
A: designators end in _A; ports CS_O=CS_BOOST1 HI=HI_BOOST1 IREF=IREF LI=LI_BOOST1 VOUT=75V VS_O=VS_BOOST1
B: designators end in _B; ports CS_O=CS_BOOST2 HI=HI_BOOST2 IREF=IREF LI=LI_BOOST2 VOUT=75V VS_O=VS_BOOST2
C: designators end in _C; ports CS_O=CS_BOOST3 HI=HI_BOOST3 IREF=IREF LI=LI_BOOST3 VOUT=75V VS_O=VS_BOOST3
D: designators end in _D; ports CS_O=CS_BOOST4 HI=HI_BOOST4 IREF=IREF LI=LI_BOOST4 VOUT=75V VS_O=VS_BOOST4

### Layout directives
net class 75V: 75V, BoostIN_A, NetL1_A_2

### Notes on the sheet
- Soft Start
- Measure
- Converter
- Drawn By:
- SVN Rev:
- Number:
- TID #:
- Orderable:
- Rev:
- Sheet Title:
- File:
- Project Title:
- Designed for:
- Assembly Variant:
- Mod. Date:
- Sheet:
- Size:
- of
- B
- http://www.ti.com
- Texas Instruments and/or its licensors do not warrant the accuracy or completeness of this specification or any information contained therein. Texas Instruments and/or its licensors do not warrant that this design will meet the specifications, will be suitable for your application or fit for any particular purpose, or will operate in an implementation. Texas Instruments and/or its licensors do not warrant that the design is production worthy. You should completely validate and test your design implementation to confirm the system functionality for your application.
- Engineer:
- Contact:
- © Texas Instruments
- (in symbol CMP-0000823-2) 1,2,3; 7,8; 5,6,
- (in symbol CMP-0109909-1) +

### Library data of the parts
C2 C3 C8 C9 = CMP-0096021-1: 10 µF ±10% 100V Ceramic Capacitor X7R 1210 (3225 Metric); Manufacturer: TDK; Cap_F: 10µF; AEC Qualified: No; Value: 10µF; SizeZ_mm: 2.85mm; TempCo: 15%; RoHS: TRUE; Digikey Part Number: 445-C3225X7R2A106K250ACCT-ND; Mouser Description: Multilayer Ceramic Chip Capacitors, Capacitance=10µF, LxWxT: 3.2x2.5x2.5mm; Mouser Part Number: 810-C3225X7R2A106K25; Supplier Part Number 1: 445-C3225X7R2A106K250ACCT-ND; Datasheet Path: datasheets/Cap-C3225X7R2A106K250AC.pdf; PackageReference: 1210; Lead Free: Yes; helpURL: https://upverter.com/upn/revision/84742aafcccd6735/; Digikey Description: COMMERCIAL GRADE GENERAL PURPOSE; Tolerance_%: 10%; datasheet: https://product.tdk.com/en/search/capacitor/ceramic/mlcc/info?part_no=C3225X7R2A106K250AC; Part Number: C3225X7R2A106K250AC; Supplier Part Number 2: 810-C3225X7R2A106K25; Operating Temperature Range: -55°C to +125°C; ComponentLink1URL: https://product.tdk.com/en/search/capacitor/ceramic/mlcc/info?part_no=C3225X7R2A106K250AC; Supplier 1: Digikey; Temperature Characteristic: X7R; PartNumber: C3225X7R2A106K250AC; ComponentLink1Description: Datasheet; Supplier 2: Mouser
C4 C11-C14 = CMP-0006618-2: CAP, CERM, 0.1 uF, 100 V, +/- 10%, X5R, 0402; Manufacturer: MuRata; TaMin_C: -55°C; Polarized: N; SizeAreaWB_mm2: 3; Value1: Unknown; U/M: EA; Value: 0.1uF; TaMax_C: 85°C; SizeZ_mm: 0.6; SizeX_mm: 1; SizeY_mm: 0.5; Cap_F: 100nF; AEC Category: Q200; Supplier Part Number 2: 96Y9228; Publisher: Texas Instruments; Supplier 2: Newark; Supplier Part Number 3: 81-GRM155R62A104KE4D; TempCo: X5R; Supplier 3: Mouser; Published: 2008-06-19; RoHS: Y; MountType: SMT; Supplier 1: Digi-Key; PackageReference: 0402; Tolerance_%: 10%; Cap_Case: 0402; Value2: 100V; SizeArea_mm2: 0.5; CompType: Capacitor; LatestRevisionDate: 2017-03-09; PartNumber: GRM155R62A104KE14D; AEC Qualified: N; ComponentLink1Description: Datasheet link; AEC Grade: N/A; Supplier Part Number 1: 490-10458-1-ND; Technology: Ceramic; ComponentLink1URL: http://psearch.en.murata.com/capacitor/product/GRM155R62A104KE14%23.pdf
C5 = CMP-0109909-1: WCAP-ATLI Aluminum Electrolytic Capacitor, Radial, THT, D10 x H16mm, 150µF, 63V; Manufacturer: Wurth Elektronik; Capacitance Tolerance: +/-20%; Dissipation Factor: 8%; Endurance: 5000h; Leakage Current: 94.5uA; Ripple Current: 900mA; Technical Reference: ATEF160151M063DSPAAE000; Cap_F: 150µF; Design Item ID: 860080775016; Category: Aluminum Electrolytic Capacitors; Diameter: 10mm; Height: 16mm; Manufacturer Part Number: 860080775016; Match Code: WCAP-ATLI; Mount: Through Hole; Operating Temperature Max: 105°C; Operating Temperature Min: -55°C; Packaging: Ammo Pack; Rated Voltage (DC): 63V; Source: Capacitors.SchLib; ComponentLink1Description: Website Link; ComponentLink1URL: https://www.we-online.com/redexpert/article/860080775016?ad; ComponentLink2Description: Datasheet Link; ComponentLink2URL: https://www.we-online.com/redexpert/spec/860080775016?ad
C6 C7 C15 C19 = CMP-0006659-2: as C1 on sheet TIDA-010933-DCDC-Top; Supplier Part Number 2: 31Y1751; Publisher: Texas Instruments; Supplier 2: Newark; Supplier Part Number 3: 81-GRM155R71E104KE4D; TempCo: X7R; Supplier 3: Mouser; Published: 2008-06-19; RoHS: Y; MountType: SMT; Supplier 1: Digi-Key; PackageReference: 0402; Tolerance_%: 10%; Cap_Case: 0402; SizeArea_mm2: 0.5; CompType: Capacitor; LatestRevisionDate: 2017-03-09; PartNumber: GRM155R71E104KE14D; AEC Qualified: N; VDC_V: 25V; ComponentLink1Description: Datasheet link; AEC Grade: N/A; Supplier Part Number 1: 490-10698-1-ND; Technology: Ceramic; ComponentLink1URL: http://search.murata.co.jp/Ceramy/image/img/A01X/G101/ENG/GRM155R71E104KE14-01.pdf
C10 = CMP-0006608-2: CAP, CERM, 1 uF, 25 V, +/- 10%, X5R, 0402; Manufacturer: MuRata; TaMin_C: -55°C; Polarized: N; SizeAreaWB_mm2: 3; Value1: Unknown; U/M: EA; Value: 1uF; TaMax_C: 85°C; SizeZ_mm: 0.6; SizeX_mm: 1; SizeY_mm: 0.5; Value2: 25V; Cap_F: 1µF; AEC Category: Q200; Supplier Part Number 2: 48W5730; Publisher: Texas Instruments; Supplier 2: Newark; Supplier Part Number 3: 81-GRM155R61E105KA2D; TempCo: X5R; Supplier 3: Mouser; Published: 2008-06-19; RoHS: Y; MountType: SMT; Supplier 1: Digi-Key; PackageReference: 0402; Tolerance_%: 10%; Cap_Case: 0402; SizeArea_mm2: 0.5; CompType: Capacitor; LatestRevisionDate: 2017-03-09; PartNumber: GRM155R61E105KA12D; AEC Qualified: ?; VDC_V: 25V; ComponentLink1Description: Datasheet link; Supplier Part Number 1: 490-10017-1-ND; Technology: Ceramic; ComponentLink1URL: http://psearch.murata.com/capacitor/product/GRM155R61E105KA12%23.pdf
C16 C22 = CMP-0006412-2: CAP, CERM, 1000 pF, 50 V, +/- 5%, C0G/NP0, 0402; Manufacturer: MuRata; TaMin_C: -55°C; Polarized: N; SizeAreaWB_mm2: 3; Value1: Unknown; U/M: EA; Value: 1000pF; TaMax_C: 125°C; SizeZ_mm: 0.6; SizeX_mm: 1; SizeY_mm: 0.5; Cap_F: 1nF; AEC Category: Q200; Supplier Part Number 2: 81-GRM1555C1H102JA1D; Publisher: Texas Instruments; Supplier 2: Mouser; Supplier Part Number 3: 8819556; TempCo: C0G/NP0; Supplier 3: Farnell; Published: 2008-06-19; RoHS: Y; MountType: SMT; Supplier 1: Digi-Key; PackageReference: 0402; Tolerance_%: 5%; Cap_Case: 0402; Value2: 50V; SizeArea_mm2: 0.5; CompType: Capacitor; LatestRevisionDate: 2017-03-09; PartNumber: GRM1555C1H102JA01D; AEC Qualified: ?; ComponentLink1Description: Datasheet link; Supplier Part Number 1: 490-3244-1-ND; Technology: Ceramic; ComponentLink1URL: http://search.murata.co.jp/Ceramy/PnsearchViewAction.do?HnOFG=ON&HnNFG=ON&SEL_CNT=50&sLang=en&sKey=GRM1555C1H102JA01D&x=9&y=9&search=startwith
C17 C21 = CMP-0006453-2: CAP, CERM, 300 pF, 50 V, +/- 5%, C0G/NP0, 0402; Manufacturer: MuRata; TaMin_C: -55°C; Polarized: N; SizeAreaWB_mm2: 3; Value1: Unknown; U/M: EA; Value: 300pF; TaMax_C: 125°C; SizeZ_mm: 0.6; SizeX_mm: 1; SizeY_mm: 0.5; AEC Category: Q200; Supplier Part Number 2: 81-GRM1555C1H301JA1D; Publisher: Texas Instruments; Supplier 2: Mouser; TempCo: C0G/NP0; Published: 2008-06-19; RoHS: Y; MountType: SMT; Supplier 1: Digi-Key; PackageReference: 0402; Tolerance_%: 5%; Cap_Case: 0402; Value2: 50V; SizeArea_mm2: 0.5; CompType: Capacitor; LatestRevisionDate: 2017-03-09; PartNumber: GRM1555C1H301JA01D; AEC Qualified: ?; Cap_F: 300pF; ComponentLink1Description: Datasheet link; Supplier Part Number 1: 490-3234-1-ND; Technology: Ceramic; ComponentLink1URL: http://search.murata.co.jp/Ceramy/PnsearchViewAction.do?HnOFG=ON&HnNFG=ON&SEL_CNT=50&sLang=en&sKey=GRM1555C1H301JA01D&x=9&y=9&search=startwith
C18 C20 = CMP-0860553-1: CAP, CERM, 22 pF, 50 V,+/- 5%, C0G/NP0, 0402; Manufacturer: Yageo; TaMax_C: 125°C; SizeY_mm: 0.5; SizeZ_mm: 0.6; TaMin_C: -55°C; SizeAreaWB_mm2: 3; SizeX_mm: 1; Polarized: N; Value: 22pF; U/M: EA; AEC Category: Q200; MountType: SMT; PackageReference: 0402; Value2: 50V; AEC Grade: N/A; SizeArea_mm2: 0.5; RoHS: Y; Tolerance_%: 5%; PartNumber: CC0402JRNPO9BN220; TempCo: C0G/NP0; AEC Qualified: N; ComponentLink1Description: Datasheet link; Cap_F: 22pF; CompType: Capacitor; Technology: Ceramic; Cap_Case: 0402; ComponentLink1URL: http://www.yageo.com/documents/recent/UPY-GPHC_X7R_6.3V-to-50V_18.pdf
D1 = CMP-0005878-5: Diode, Zener, 12 V, 200 mW, SOD-523; Manufacturer: Micro Commercial Components; SizeAreaWB_mm2: 5.13; Value1: 0.2W; AEC Category: Q101; SizeY_mm: 0.9; RJA_CperW: 625; SizeX_mm: 1.7; SizeArea_mm2: 1.53; Power_W: 200mW; SizeZ_mm: 0.65; AEC Qualified: ?; RoHS: Y; CompType: Zener; MountType: SMT; ComponentLink1URL: http://www.mccsemi.com/up_pdf/BZT52C2V4T~BZT52C39T(SOD-523).PDF; ComponentLink1Description: Datasheet link; PackageReference: SOD-523; PartNumber: BZT52C12T-TP; Vz_V: 12V
J1 = CMP-0054978-1: Therminal Block, 5 mm, 2-pole, Tin, TH; Manufacturer: TE Connectivity; CT: TRUE; CompType: Terminal Block; CNHeader: FALSE; ComponentLink1URL: http://www.te.com/commerce/DocumentDelivery/DDEController?Action=showdoc&DocId=Customer+Drawing%7F282856%7FD5%7Fpdf%7FEnglish%7FENG_CD_282856_D5.pdf%7F282856-2; Publisher: Texas Instruments; Supplier Part Number 2: 12H8485; Supplier 3: Mouser; Supplier 1: Digi-Key; PackageReference: TH, 2-Leads, Body 10x10mm, Pitch 5mm; LatestRevisionDate: 26/05/2017; RoHS: Y; Supplier Part Number 1: A98355-ND; Supplier Part Number 3: 571-282856-2; Supplier 2: Newark; MountType: TH; PartNumber: 282856-2; ComponentLink1Description: Datasheet URL
J10 = CMP-0032022-2: Banana Jack Connector Standard Banana Solder Red; Manufacturer: CLIFF Electronic Components; ContactFinish: Gold; Current_A: 24A; Voltage_V: 1kV; AEC Qualified: No; Conn Orientation: Horizontal; Is Female: yes; SizeZ_mm: 12.5mm; Standoff Height: 0.7mm; PackageReference: CONN_BANANA_JACK; PartNumber: FCR7350R; PinCount: 1; RoHS: TRUE; Supplier 1: Digikey; Supplier Part Number 1: 4654-FCR7350R-ND; Part Number: FCR7350R; datasheet: https://www.farnell.com/datasheets/3216443.pdf; Datasheet Path: datasheets/Conn-FCR7350R.pdf; Digikey Description: 4MM PANEL SKT S16N-PC RED; Digikey Part Number: 4654-FCR7350R-ND; helpURL: https://upverter.com/upn/revision/ed2a00f5535e7036/; Lead Free: Yes; Operating Temperature Range: -40°C to +80°C; ComponentLink1Description: Datasheet; ComponentLink1URL: https://www.farnell.com/datasheets/3216443.pdf
J11 = CMP-0032021-2: Banana Jack Connector Standard Banana Solder Black; Manufacturer: CLIFF Electronic Components; ContactFinish: Gold; Current_A: 24A; Voltage_V: 1kV; AEC Qualified: No; Conn Orientation: Horizontal; Is Female: yes; SizeZ_mm: 12.5mm; Standoff Height: 0.7mm; PackageReference: CONN_BANANA_JACK; PartNumber: FCR7350B; PinCount: 1; RoHS: TRUE; Supplier 1: Digikey; Supplier Part Number 1: 4654-FCR7350B-ND; Part Number: FCR7350B; datasheet: https://www.cliffuk.co.uk/products/testleads/sockets/fcr7350.pdf; Datasheet Path: datasheets/Conn-FCR7350B.pdf; Digikey Description: 4MM PANEL SKT S16N-PC BLACK; Digikey Part Number: 4654-FCR7350B-ND; helpURL: https://upverter.com/upn/revision/598fb79d4513ed1f/; Lead Free: Yes; Operating Temperature Range: -40°C to +80°C; ComponentLink1Description: Datasheet; ComponentLink1URL: https://www.cliffuk.co.uk/products/testleads/sockets/fcr7350.pdf
L1 = CMP-0121182-1: Shielded High Current Power Inductor, 22uH, 19A; Manufacturer: Coilcraft; AEC Qualified: No; DCR_ohm: 2.6m; Ind_H: 22µH; Irms: 26A; Isat: 12.2A; Material: Ferrite; SizeZ_mm: 22.74mm; Self Resonant Frequency: 13MHz; Shrouded: true; TaMax_C: +85°C; TaMin_C: -40°C; Test Frequency: 300kHz; Tolerance_%: 10%; PackageReference: PTH_INDUCTOR_26MM92_16MM46; PartNumber: VER2923-223KL; RoHS: TRUE; Supplier 2: Mouser; Supplier Part Number 2: 994-VER2923-223KL; Technology: Wirewound; Part Number: VER2923-223KL; datasheet: https://www.coilcraft.com/getmedia/adea7832-b1eb-4914-bb9d-ee0460160a1e/ver2923.pdf; Datasheet Path: datasheets/Ind-VER2923-223KL.pdf; helpURL: https://upverter.com/upn/revision/f8f170d3e1acfc38/; Lead Free: Yes; Mouser Description: Inductor, 22UH, 26A, Pwr, 12.2MHZ; Mouser Part Number: 994-VER2923-223KL; Operating Temperature Range: to; ComponentLink1Description: Datasheet; ComponentLink1URL: https://www.coilcraft.com/getmedia/adea7832-b1eb-4914-bb9d-ee0460160a1e/ver2923.pdf
Q1 = CMP-0000823-2: MOSFET, N-CH, 60 V, 100 A, DNK0008A (VSON-CLIP-8); Alternate Manufacturer: None; Manufacturer: Texas Instruments; SizeZ_mm: 1; ChType: N; Value2: 41 nC; Value1: 0.003; VdsMax_V: 60V; SizeX_mm: 6; SizeY_mm: 5; Vgs_V: 20V; Value: 60V; Rdson45_ohm: 3.3m; SizeArea_mm2: 30; AEC Category: Q101; IdsMax_A: 100A; SizeAreaWB_mm2: 56; U/M: EA; QgTyp_nC: 41; Supplier 2: Mouser; Supplier 1: Digi-Key; Supplier Part Number 1: 296-41076-1-ND; Supplier Part Number 2: 595-CSD18540Q5B; PartNumber: CSD18540Q5B; ComponentLink1Description: Datasheet link; ComponentLink1URL: http://www.ti.com/lit/ds/symlink/csd18540q5b.pdf; CompType: MOSFET; PackageReference: DNK0008A; AEC Qualified: N; RoHS: Y; MountType: SMT
R4 = CMP-0078821-1: RES, 0.001, 1%, 1 W, AEC-Q200 Grade 0, 1206; Manufacturer: Bourns; Value_Code: 1L000; SizeArea_mm2: 5.12; AEC Qualified: Y; AEC Category: Q200; Res_ohm: 1m; Value: 0.001; SizeZ_mm: 1.35; EIA_Code: E96; TempCo: 50 ppm/C; AEC Grade: 0; SizeY_mm: 1.6; Power_W: 1W; SizeX_mm: 3.2; ComponentLink1Description: Datasheet link; RoHS: Y; Tolerance_%: 1%; PackageReference: 1206; Technology: Metal Film; PartNumber: CRF1206-FZ-R001ELF; Value2: 1W; ComponentLink1URL: http://www.bourns.com/docs/Product-Datasheets/crf.pdf; Value1: 1%; CompType: Resistor; MountType: SMT
R5 = CMP-0022735-5: RES, 100 k, 1%, 0.1 W, 0603; Manufacturer: Yageo; Power_W: 100mW; TempCo: 100 ppm/C; Value: 100k; EIA_Code: E96; SizeX_mm: 1.6; SizeY_mm: 0.8; SizeZ_mm: 1; Value2: 0.1W; SizeArea_mm2: 1.28; AEC Qualified: N; VDC_V: 75V; AEC Category: Q200; SizeAreaWB_mm2: 4.68; Supplier Part Number 2: 603-RC0603FR-07100KL; Supplier 2: Mouser; Supplier Part Number 3: 9238727; Supplier 3: Farnell; Value_Code: 100k; RoHS: Y; Value1: 1%; MountType: SMT; Supplier 1: Digi-Key; PackageReference: 0603; Tolerance_%: 1%; Res_ohm: 100k; CompType: Resistor; PartNumber: RC0603FR-07100KL; ComponentLink1Description: Datasheet link; Supplier Part Number 1: 311-100KHRCT-ND; Technology: Thick Film; ComponentLink1URL: http://www.yageo.com/pdf/Pu-RC0603_51_PbFree_L_2.pdf; AEC Grade: N/A
R6 = CMP-0024182-3: RES, 39.2 k, 0.1%, 0.1 W, 0603; Manufacturer: Yageo America; Power_W: 100mW; TempCo: 25 ppm/C; Value_Code: 39k2; U/M: EA; Value: 39.2k; EIA_Code: E192; SizeX_mm: 1.6; SizeY_mm: 0.8; SizeZ_mm: 1; Value2: 0.1W; SizeArea_mm2: 1.28; VDC_V: 75V; AEC Category: Q200; Publisher: Texas Instruments; Published: 2008-06-26; RoHS: Y; Value1: 0.1%; MountType: SMT; PackageReference: 0603; Tolerance_%: 0.1%; Res_ohm: 39.2k; CompType: Resistor; LatestRevisionDate: 2017-03-09; PartNumber: RT0603BRD0739K2L; AEC Qualified: ?; ComponentLink1Description: Datasheet link; Technology: Thin Film; ComponentLink1URL: http://www.yageo.com/pdf/PYu-RT_1-to-0.05_RoHS_L_3.pdf
R7 R10 = CMP-0026900-3: RES, 2.7, 5%, 0.063 W, AEC-Q200 Grade 0, 0402; Manufacturer: Vishay-Dale; Power_W: 63mW; TempCo: 200 ppm/C; Value_Code: 2R70; Value: 2.7; EIA_Code: E24; SizeX_mm: 1; SizeY_mm: 0.5; SizeZ_mm: 0.6; Value2: 0.063W; AEC Qualified: Y; VDC_V: 50V; AEC Category: Q200; AEC Grade: 0; Supplier Part Number 2: 71-CRCW04022R70JNED; Supplier 2: Mouser; Supplier Part Number 3: 1739059; Supplier 3: Farnell; RoHS: E; Value1: 5%; MountType: SMT; Supplier 1: Digi-Key; PackageReference: 0402; Tolerance_%: 5%; Res_ohm: 2.7; SizeArea_mm2: 0.5; CompType: Resistor; PartNumber: CRCW04022R70JNED; ComponentLink1Description: Datasheet link; Supplier Part Number 1: 541-2.7JCT-ND; Technology: Thick Film; ComponentLink1URL: http://www.vishay.com/docs/20035/dcrcwe3.pdf
R8 = CMP-0026721-1: RES, 100 k, 1%, 0.0625 W, 0402; Manufacturer: Yageo America; Power_W: 62.5mW; TempCo: 100 ppm/C; U/M: EA; Value: 100k; EIA_Code: E96; SizeX_mm: 1; SizeY_mm: 0.5; SizeZ_mm: 0.6; AEC Qualified: N; VDC_V: 50V; AEC Category: Q200; ComponentLink1URL: http://www.yageo.com/documents/recent/PYu-RC0402_51_RoHS_L_6_r.pdf; Supplier Part Number 2: 67R9887; Publisher: Texas Instruments; Supplier 2: Newark; Supplier Part Number 3: 603-RC0402FR-07100KL; Supplier 3: Mouser; Published: 2008-06-26; Value_Code: 100k; RoHS: Y; Value1: 1%; MountType: SMT; Supplier 1: Digi-Key; PackageReference: 0402; Tolerance_%: 1%; Res_ohm: 100k; Value2: 0.0625W; SizeArea_mm2: 0.5; CompType: Resistor; LatestRevisionDate: 2017-03-09; PartNumber: RC0402FR-07100KL; ComponentLink1Description: Datasheet link; AEC Grade: N/A; Supplier Part Number 1: 311-100KLRCT-ND; Technology: Thick Film
R9 R12 R14 R16 = CMP-0026738-1: RES, 49.9, 1%, 0.063 W, 0402; Manufacturer: Yageo America; Power_W: 63mW; TempCo: 100 ppm/C; Value_Code: 49R9; U/M: EA; Value: 49.9; EIA_Code: E96; SizeX_mm: 1; SizeY_mm: 0.5; SizeZ_mm: 0.6; Value2: 0.063W; AEC Qualified: N; VDC_V: 50V; AEC Category: Q200; ComponentLink1URL: http://www.yageo.com/documents/recent/PYu-RC_Group_51_RoHS_L_1.pdf; Supplier Part Number 2: 67R9942; Publisher: Texas Instruments; Supplier 2: Newark; Supplier Part Number 3: 603-RC0402FR-0749R9L; Supplier 3: Mouser; Published: 2008-06-26; RoHS: Y; Value1: 1%; MountType: SMT; Supplier 1: Digi-Key; PackageReference: 0402; Tolerance_%: 1%; Res_ohm: 49.9; SizeArea_mm2: 0.5; CompType: Resistor; LatestRevisionDate: 2017-03-09; PartNumber: RC0402FR-0749R9L; ComponentLink1Description: Datasheet link; AEC Grade: N/A; Supplier Part Number 1: 311-49.9LRCT-ND; Technology: Thick Film
R11 = CMP-0026770-1: RES, 1.00 k, 0.1%, 0.063 W, 0402; Manufacturer: Panasonic; Power_W: 63mW; TempCo: 25 ppm/C; Value_Code: 1k00; U/M: EA; Value: 1.00k; EIA_Code: E192; Res_ohm: 1k; SizeX_mm: 1; SizeY_mm: 0.5; SizeZ_mm: 0.6; Value2: 0.063W; VDC_V: 50V; AEC Category: Q200; ComponentLink1URL: http://industrial.panasonic.com/www-data/pdf/AOA0000/AOA0000CE26.pdf; Supplier Part Number 2: 53W8332; Publisher: Texas Instruments; Supplier 2: Newark; Supplier Part Number 3: 667-ERA-2AEB102X; Supplier 3: Mouser; Published: 2008-06-26; RoHS: Y; Value1: 0.1%; MountType: SMT; Supplier 1: Digi-Key; PackageReference: 0402; Tolerance_%: 0.1%; SizeArea_mm2: 0.5; CompType: Resistor; LatestRevisionDate: 2017-03-09; PartNumber: ERA-2AEB102X; AEC Qualified: ?; ComponentLink1Description: Datasheet link; Supplier Part Number 1: P1.0KDCCT-ND; Technology: Thin Film
R13 R15 = CMP-0078669-1: RES, 10.0 k, 1%, 0.063 W, 0402; Manufacturer: Yageo America; Power_W: 63mW; Green_Lifecycle: Active; TempCo: 100 ppm/C; Value_Code: 10k0; Green_REACh: Passed; Value: 10.0k; EIA_Code: E96; Res_ohm: 10k; SizeX_mm: 1; SizeY_mm: 0.5; SizeZ_mm: 0.6; Value2: 0.063W; AEC Qualified: N; AEC Category: Q200; ComponentLink1URL: http://www.yageo.com/documents/recent/PYu-RC_Group_51_RoHS_L_8.pdf; Supplier Part Number 2: 98K7499; Supplier 2: Newark; Supplier Part Number 3: 603-RC0402FR-0710KL; Supplier 3: Mouser; RoHS: Y; Value1: 1%; MountType: SMT; Green_EU RoHS-2: Passed; Supplier 1: Digi-Key; Green_EU RoHS: Passed with Exemption; PackageReference: 0402; Tolerance_%: 1%; SizeArea_mm2: 0.5; CompType: Resistor; PartNumber: RC0402FR-0710KL; ComponentLink1Description: Datasheet link; AEC Grade: N/A; Supplier Part Number 1: 311-10.0KLRCT-ND; Technology: Thick Film
R17 R18 = CMP-0092617-1: 200 Ohms ±5% 0.063W, 1/16W Chip Resistor 0402 (1005 Metric) Moisture Resistant Thick Film; Manufacturer: YAGEO; SizeZ_mm: 0.4mm; TempCo: 100ppm/°C; AEC Qualified: No; Power_W: 63mW; VDC_V: 50V; Technology: Thick Film; Part Number: RC0402JR-07200RL; Lead Free: Yes; Supplier 1: Digikey; Digikey Description: RES SMD 200 OHM 5% 1/16W 0402; Res_ohm: 200; datasheet: http://www.yageo.com/documents/recent/PYu-RC_Group_51_RoHS_L_8.pdf; helpURL: https://upverter.com/upn/revision/a0a435665daee534/; PartNumber: RC0402JR-07200RL; Supplier Part Number 1: 311-200JRCT-ND; Datasheet Path: datasheets/Res-RC0402JR-07200RL.pdf; Mouser Part Number: 603-RC0402JR-07200RL; ComponentLink1Description: Datasheet; Supplier Part Number 2: 603-RC0402JR-07200RL; RoHS: FALSE; Mouser Description: Thick Film Resistors - SMD 200 OHM 5%; Supplier 2: Mouser; Series: RC_L; Tolerance_%: 5%; Digikey Part Number: 311-200JRCT-ND; PackageReference: 0402; ComponentLink1URL: http://www.yageo.com/documents/recent/PYu-RC_Group_51_RoHS_L_8.pdf; Operating Temperature Range: -55°C to +155°C
TP50 = CMP-0055137-2: Test Point, Miniature, Red, TH; Manufacturer: Keystone Electronics; Green_REACh: Passed; Green_Lifecycle: Active; ContactFinish: Silver; CNHeader: FALSE; CT: TRUE; Green_EU RoHS-2: Incomplete; Supplier 2: Mouser; PackageReference: Red Miniature Testpoint; MountType: TH; PartNumber: 5000; LatestRevisionDate: 26/05/2017; RoHS: Y; Publisher: Texas Instruments; ComponentLink1URL: http://www.keyelco.com/userAssets/file/M60-2p60.pdf; ComponentLink1Description: Datasheet URL; CompType: Test Point; Supplier Part Number 1: 36-5000-ND; Supplier 1: Digi-Key; Green_EU RoHS: Passed; Color: Red; Supplier Part Number 2: 534-5000
TP51 = CMP-0055138-2: as TP1 on sheet TIDA-010933-DCDC-Top; Color: Black; PackageReference: Black Miniature Testpoint; LatestRevisionDate: 26/05/2017; MountType: TH; Publisher: Texas Instruments; Green_EU RoHS-2: Incomplete; PartNumber: 5001; Supplier 1: Digi-Key; Supplier Part Number 1: 36-5001-ND; ComponentLink1URL: http://www.keyelco.com/userAssets/file/M60-2p60.pdf; ComponentLink1Description: Datasheet URL; RoHS: Y; Supplier 2: Mouser; Green_EU RoHS: Passed; CompType: Test Point; Supplier Part Number 2: 534-5001
U1 = CMP-0120692-1: 100-V, 53-A GaN Half-Bridge Power Stage; Manufacturer: Texas Instruments; SizeZ_mm: 0.85mm; AEC Qualified: No; Max Supply Voltage: 5.25V; Min Supply Voltage: 4.75V; Nominal Supply Current: 12mA; Number Of Outputs: 1; Standoff Height: 0mm; TJmax_C: +125°C; PackageReference: VQFN-FCRLF16; PartNumber: LMG2100R044; RoHS: UNKNOWN; Operating Temperature Range: -40°C to +125°C; Part Number: LMG2100R044; helpURL: https://upverter.com/upn/revision/6cbafed2923246a8/
U2 = CMP-0081556-1: Low-Power, Rail-to-Rail In and Out, 1-MHz Operational Amplifier, DCK0005A (SOT-SC70-5); Alternate PartNumber: TLV9001IDCKT; Alternate Manufacturer: Texas Instruments; SizeAreaWB_mm2: 9.3; SizeZ_mm: 1.1; SizeX_mm: 2.1; SizeY_mm: 2; SizeArea_mm2: 4.2; CompType: IC; AEC Qualified: N; AEC Category: Q200; ComponentLink1URL: http://www.ti.com/lit/ds/symlink/tlv9001.pdf; PackageDescription: SOT-SC70-5; MountType: SMT; ComponentLink2URL: http://www.ti.com/product/tlv9001; ComponentLink3Description: Online Datasheet; ComponentLink2Description: Product Folder; Manufacturer: Texas Instruments; ComponentLink3URL: http://www.ti.com/product/tlv9001/datasheet; PackageReference: DCK0005A; PartNumber: TLV9001IDCKR; ComponentLink1Description: Datasheet Link
U3 = CMP-0121179-1: Bidirectional, Low- and High-Side Voltage Output, Current-Sense Amplifiers; Manufacturer: Texas Instruments; SizeZ_mm: 1.1mm; AEC Qualified: No; Bandwidth: 150kHz; Input Bias Current: 75uA; Input Offset Voltage: 0.1mV; Max Supply Voltage: 5.5V; Min Supply Voltage: 2.7V; Nominal Supply Current: 195uA; Number Of Channels: 1; Standoff Height: 0mm; TaMax_C: +125°C; TaMin_C: -40°C; TJmax_C: +150°C; Voltage Gain: 0.1V/mV; PackageReference: SC70-6; PartNumber: INA181A3IDCKR; RoHS: TRUE; Operating Temperature Range: -40°C to +125°C; Part Number: INA181A3IDCKR; datasheet: https://www.ti.com/lit/ds/symlink/ina181.pdf; Datasheet Path: datasheets/IC-INA181A3IDCKR.pdf; Digikey Description: IC; Digikey Part Number: 296-INA181A3IDCKRTR-ND; helpURL: https://upverter.com/upn/revision/d8117208d90cf8f1/; Lead Free: Yes; Mouser Part Number: 595-INA181A3IDCKR; ComponentLink1Description: Datasheet; ComponentLink1URL: https://www.ti.com/lit/ds/symlink/ina181.pdf